# EasyEDA schematic SCH_single_recovery v1 copy_2022-11-08.json

## Sheets
1 Sheet_1 copy copy: TITLE: Sheet_1; REV: 1.0; Date: 2022-09-22; Sheet: 1/1; Drawn By: cmucheru; Company: Nakuja project
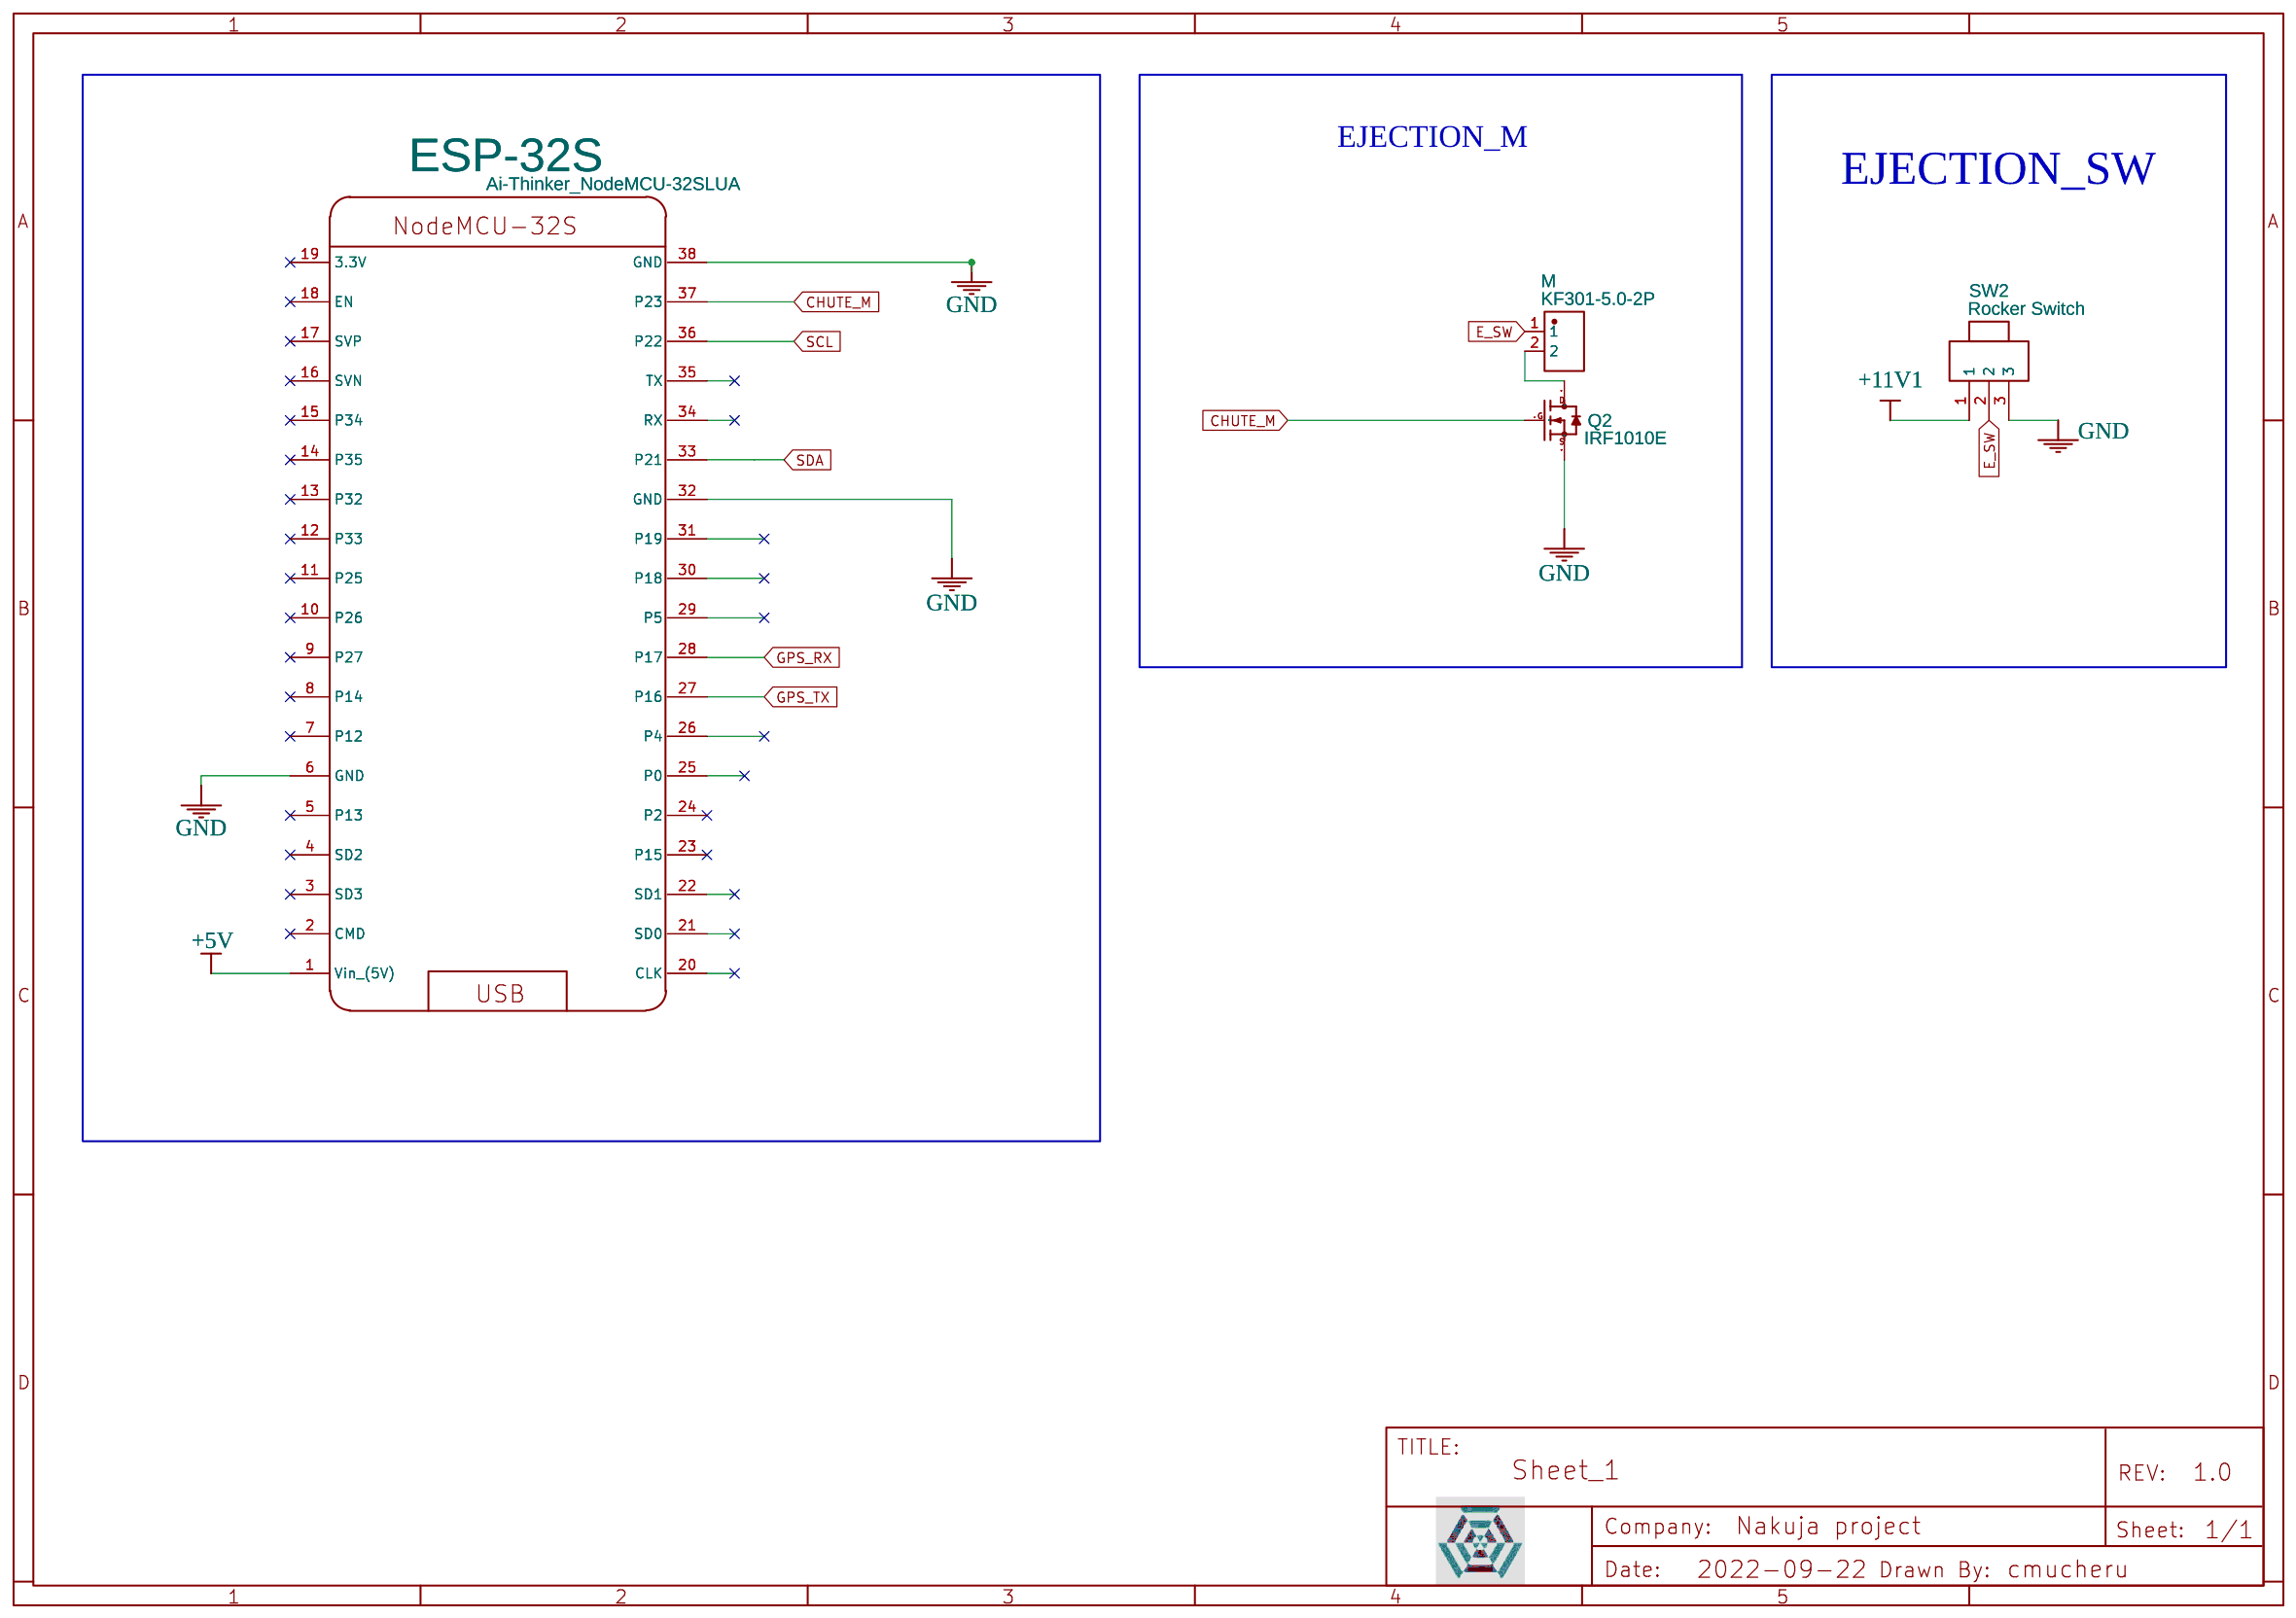
[diagram p0: Sheet_1 copy copy]
2 Sheet_2 copy copy: TITLE: Sheet_2
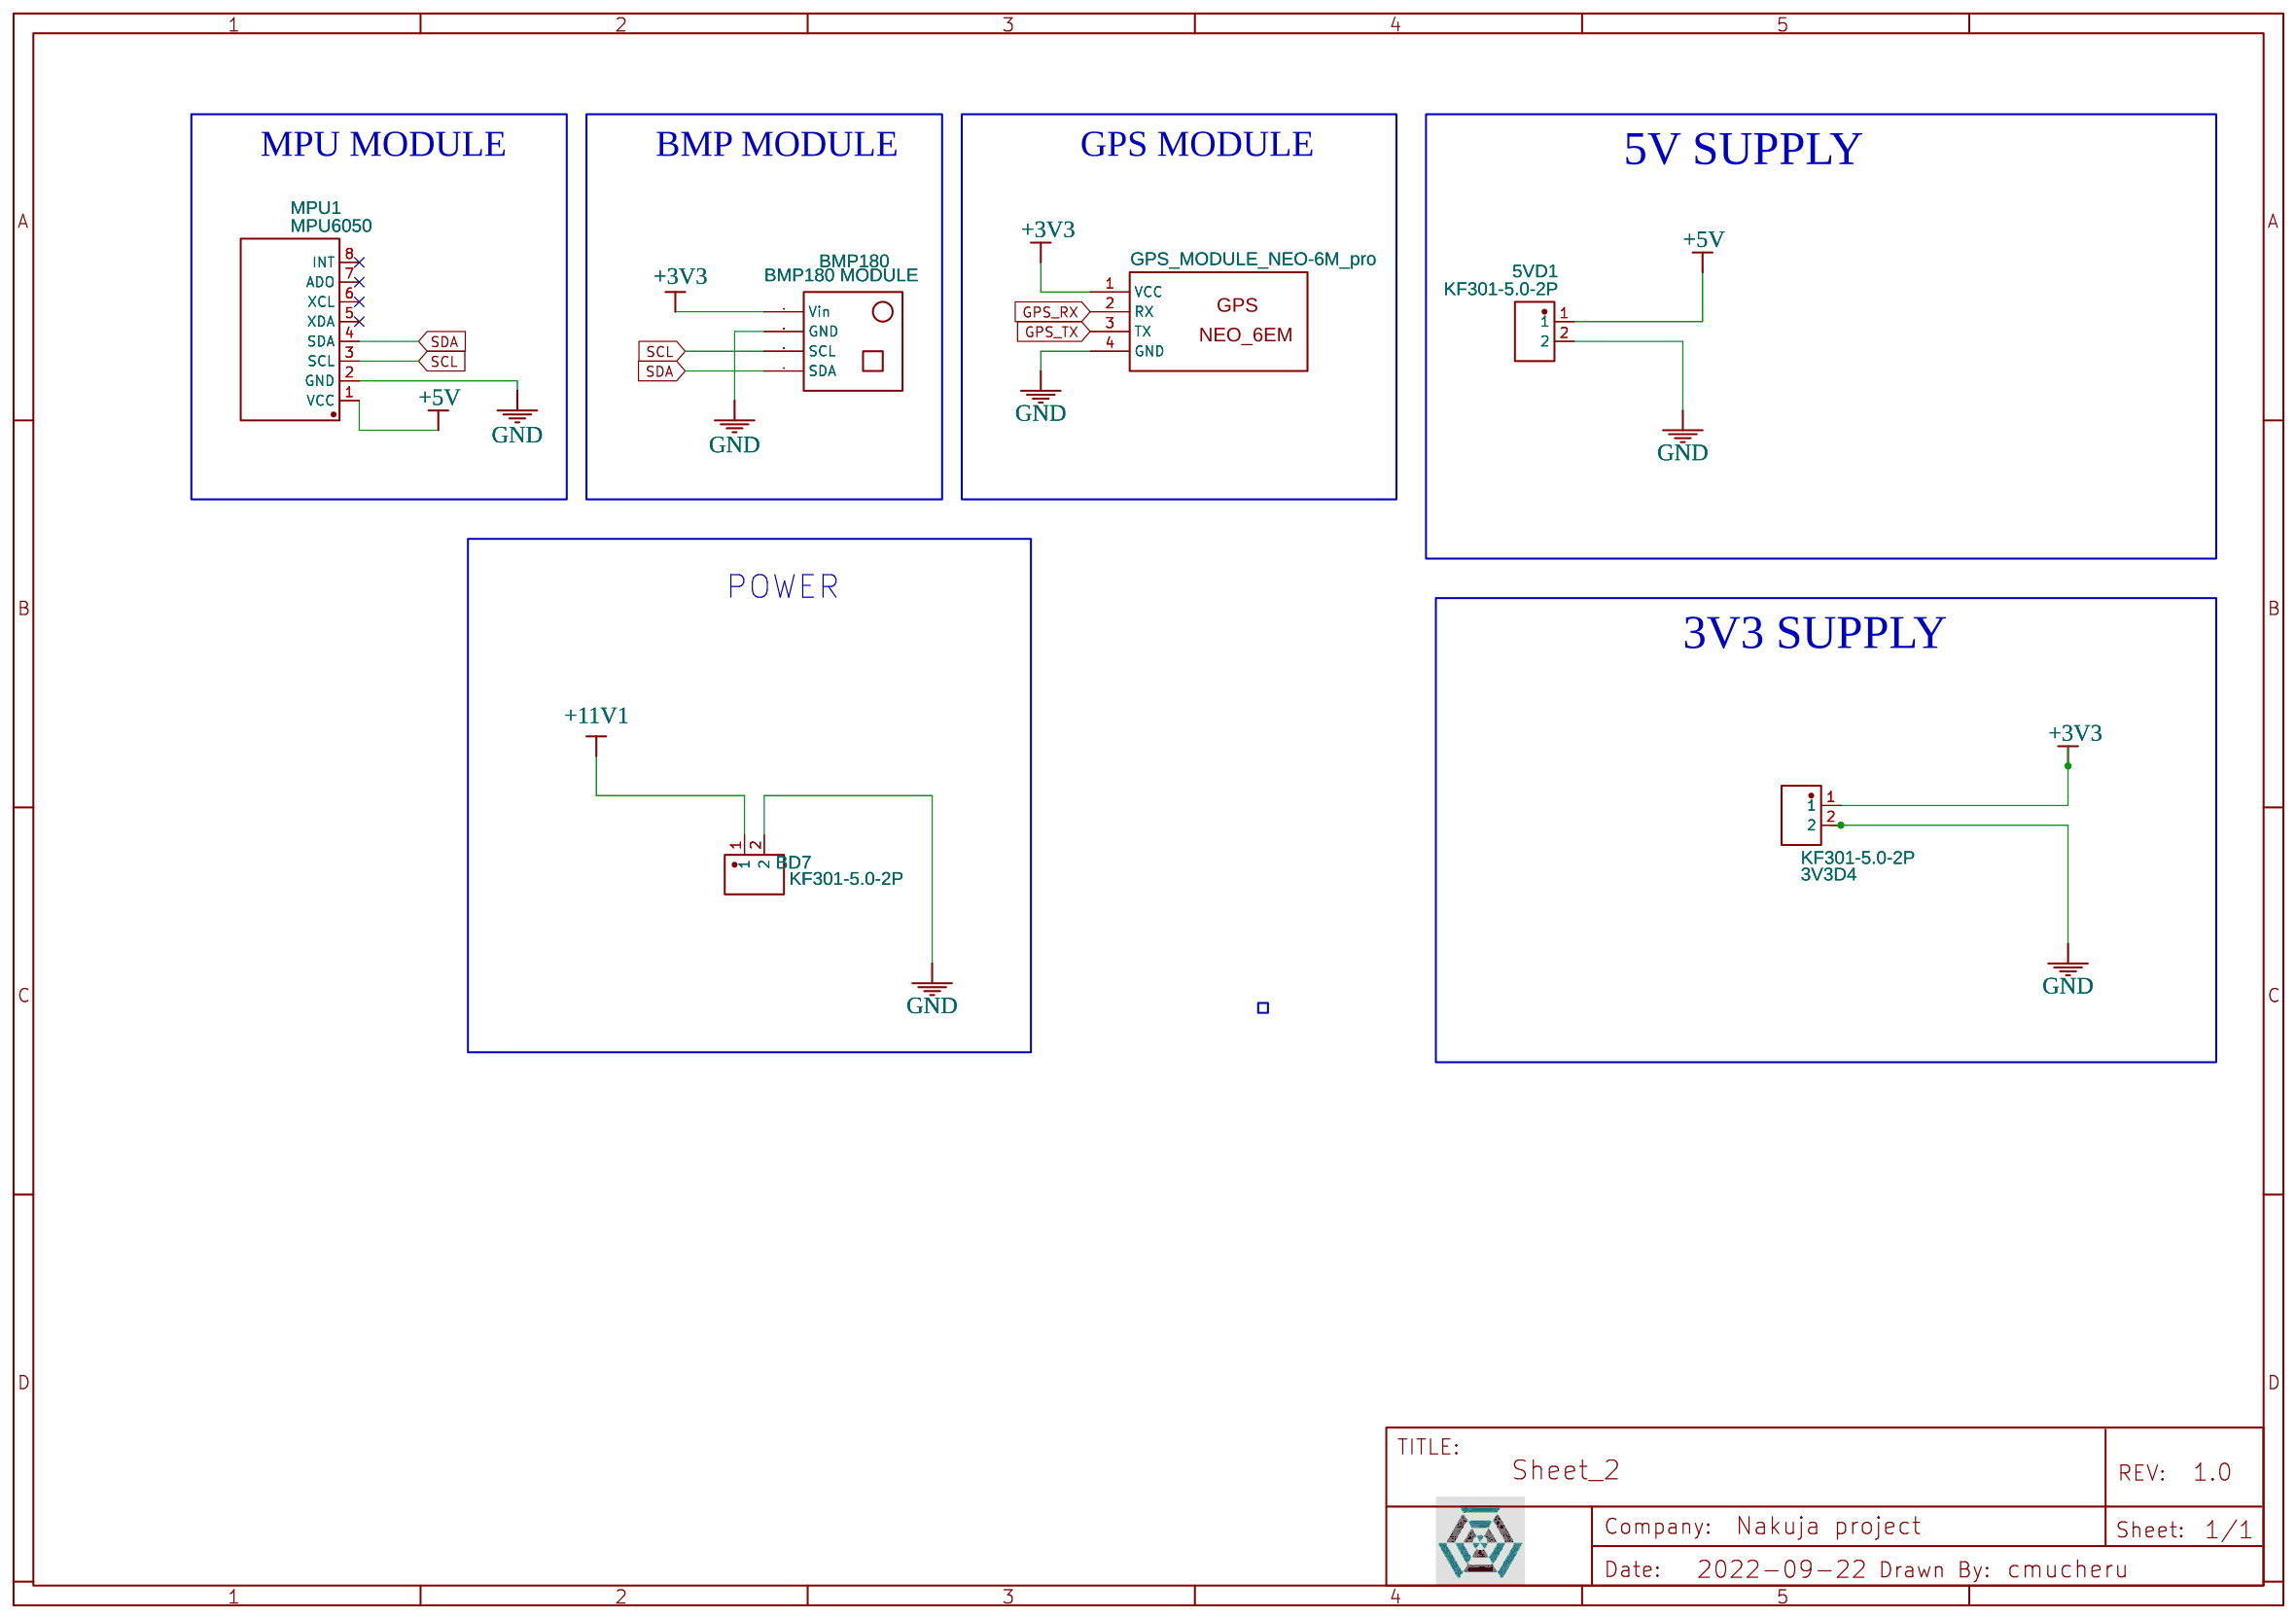
[diagram p1: Sheet_2 copy copy]

## Parts
sheet Sheet_1 copy copy
ESP-32S  Ai-Thinker_NodeMCU-32SLUA  [AI-THINKER_NODEMCU-32SLUA]
M  KF301-5.0-2P  [CONN-TH_P5.00_KF301-5.0-2P]
Q2  IRF1010E  [DC-MOSFET-TO-220]
SW2  Rocker Switch  [ROCKER SWITCH TH]
sheet Sheet_2 copy copy
3V3D4  KF301-5.0-2P  [CONN-TH_P5.00_KF301-5.0-2P]
5VD1  KF301-5.0-2P  [CONN-TH_P5.00_KF301-5.0-2P]
BD7  KF301-5.0-2P  [CONN-TH_P5.00_KF301-5.0-2P]
BMP180  BMP180 MODULE  [BMP180 MODULE (HW-596)]
GPS_NEO-2EM  GPS_MODULE_NEO-6M_pro  [GPS_MODULE]
MPU1  MPU6050  [MPU6050]

## Library data of the parts
ESP-32S = Ai-Thinker_NodeMCU-32SLUA: Supplier: LCSC; Supplier Part: C111436; Manufacturer: Ai-Thinker; Manufacturer Part: NodeMCU-32SLua; Contributor: jobsonp checked by LCSC
3V3D4 5VD1 BD7 M = KF301-5.0-2P: Supplier: LCSC; Supplier Part: C474881; Manufacturer: Cixi Kefa Elec; Contributor: LCSC; JLCPCB Part Class: Extended Part
Q2 = Mosfet-N: Contributor: dina
SW2 = Rocker Switch: Mounted: Yes
BMP180 = BMP180 MODULE: Manufacturer Part: BMP180 (HW-596); Contributor: esguti
GPS_NEO-2EM = GPS_MODULE_NEO-6M_pro: Contributor: Sanchezz2; sourceId: cy4mEWdvN
MPU1 = MPU6050: Supplier Part: GY521; Contributor: rahulaggarwal

## Nets
+3V3: 3V3D4.1 BMP180.1(Vin) GPS_NEO-2EM.1(VCC)
+5V: 5VD1.1 ESP-32S.1(Vin (5V)) MPU1.1(VCC)
+11V1: BD7.1 SW2.1
GND: 3V3D4.2 5VD1.2 BD7.2 BMP180.2(GND) ESP-32S.6(GND) ESP-32S.32(GND) ESP-32S.38(GND) GPS_NEO-2EM.4(GND) MPU1.2(GND) Q2.3(S) SW2.3
CHUTE_M: ESP-32S.37(P23) Q2.1(G)
E_SW: M.1 SW2.2
GPS_RX: ESP-32S.28(P17) GPS_NEO-2EM.2(RX)
GPS_TX: ESP-32S.27(P16) GPS_NEO-2EM.3(TX)
SCL: BMP180.3(SCL) ESP-32S.36(P22) MPU1.3(SCL)
SDA: BMP180.4(SDA) ESP-32S.33(P21) MPU1.4(SDA)
Net-(M-2): M.2 Q2.2(D)

Not connected (* = marked no-connect by the designer): ESP-32S 2(CMD)* 3(SD3)* 4(SD2)* 5(P13)* 7(P12)* 8(P14)* 9(P27)* 10(P26)* 11(P25)* 12(P33)* 13(P32)* 14(P35)* 15(P34)* 16(SVN)* 17(SVP)* 18(EN)* 19(3.3V)* 20(CLK) 21(SD0) 22(SD1) 23(P15)* 24(P2)* 25(P0) 26(P4) 29(P5) 30(P18) 31(P19) 34(RX) 35(TX); MPU1 5(XDA)* 6(XCL)* 7(ADO)* 8(INT)*

## Notes on the sheets
sheet 1
- EJECTION_M
- EJECTION_SW
sheet 2
- MPU MODULE
- BMP MODULE
- GPS MODULE
- 5V SUPPLY
- POWER
- 3V3 SUPPLY
